# Altium schematic sheet PowerSupply.SchDoc: =ProjectDescription
size 420 x 297 mm; Address1: Address1; Address2: Address2; Address3: Address3; Address4: Address4; SheetNumber: 2; SheetTotal: 2; Scale: 1:1; DocumentType: Схема электрическая принципиальная
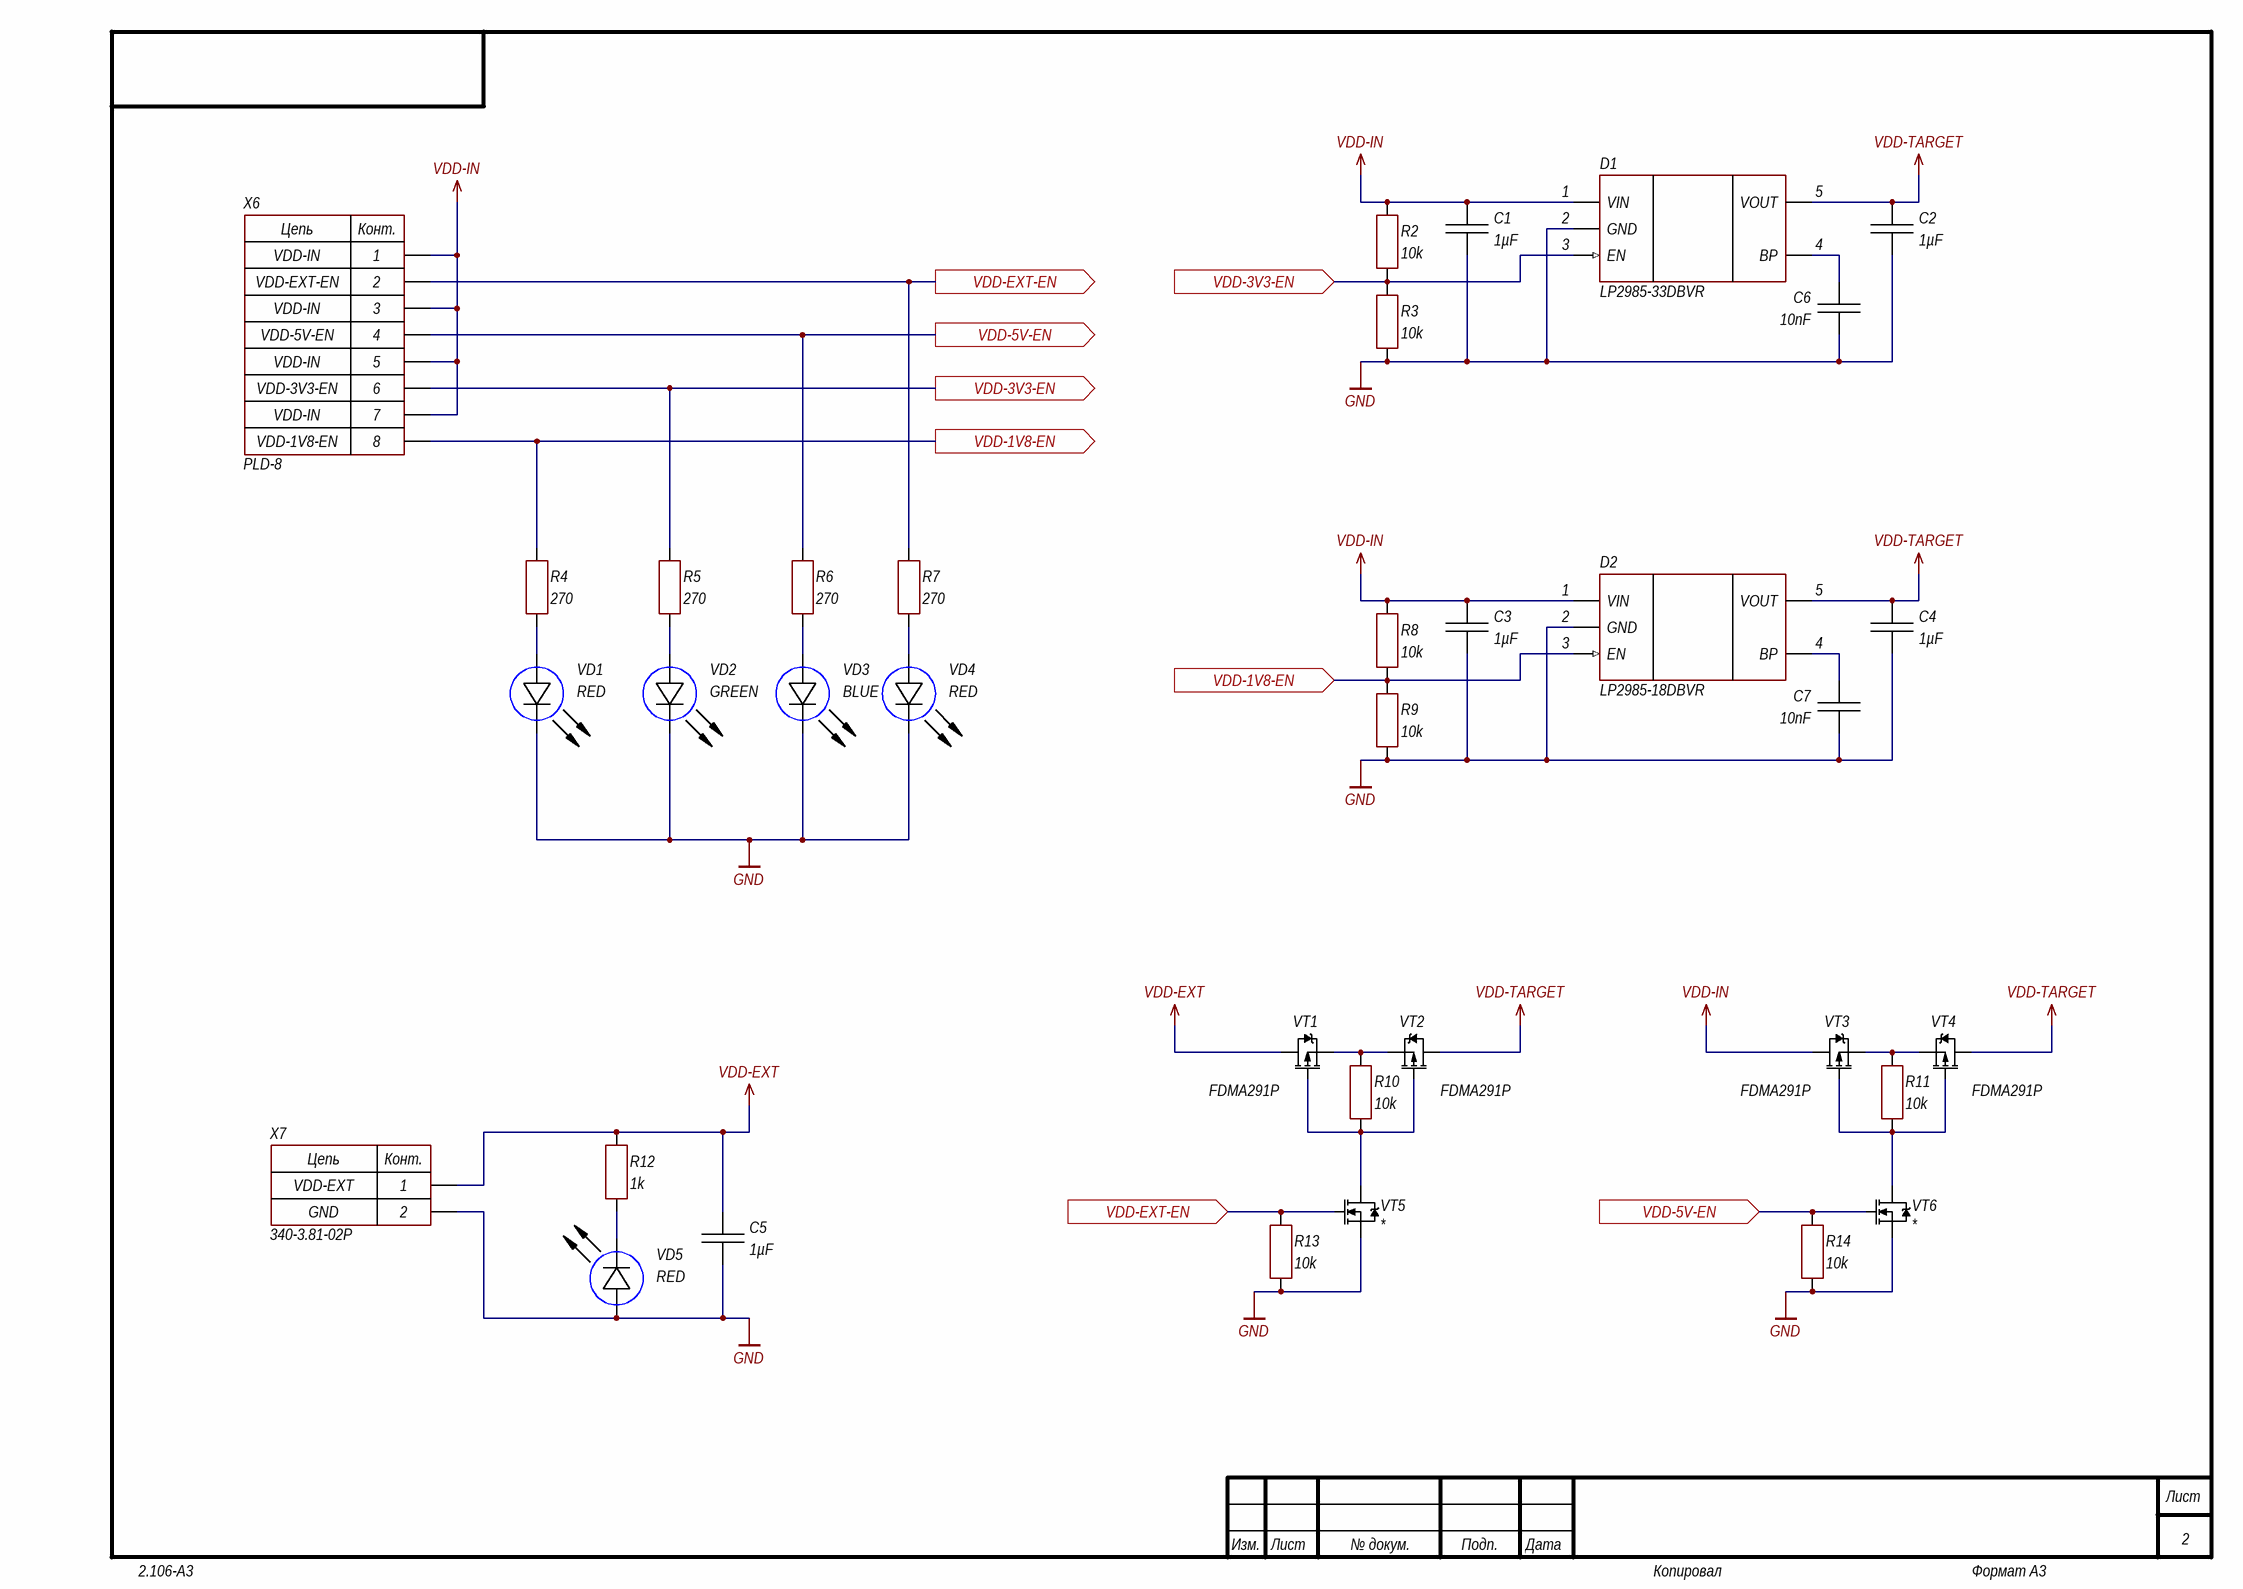
[diagram p0: PowerSupply.SchDoc]

## Parts
C1  1µF  [CH0603CM]
C2  1µF  [CH0603CM]
C3  1µF  [CH0603CM]
C4  1µF  [CH0603CM]
C5  1µF  [CH0603CM]
C6  10nF  [CH0603CM]
C7  10nF  [CH0603CM]
D1  LP2985-33DBVR  [SOT23-5]
D2  LP2985-18DBVR  [SOT23-5]
R2  10k  [CH0402R]
R3  10k  [CH0402R]
R4  270  [CH0402R]
R5  270  [CH0402R]
R6  270  [CH0402R]
R7  270  [CH0402R]
R8  10k  [CH0402R]
R9  10k  [CH0402R]
R10  10k  [CH0402R]
R11  10k  [CH0402R]
R12  1k  [CH0402R]
R13  10k  [CH0402R]
R14  10k  [CH0402R]
VD1  RED  [CH0402LR]
VD2  GREEN  [CH0402LG]
VD3  BLUE  [CH0402LB]
VD4  RED  [CH0402LR]
VD5  RED  [CH0402LR]
VT1  FDMA291P  [MicroFET 2x2]
VT2  FDMA291P  [MicroFET 2x2]
VT3  FDMA291P  [MicroFET 2x2]
VT4  FDMA291P  [MicroFET 2x2]
VT5  *  [DFN1006-3L]
VT6  *  [DFN1006-3L]
X6  PLD-8  [CON: PLD-8]
X7  340-3.81-02P  [CON: 340-3.81-02P]

## Ports
VDD-1V8-EN (in), VDD-1V8-EN (out), VDD-3V3-EN (in), VDD-3V3-EN (out), VDD-5V-EN (in), VDD-5V-EN (out), VDD-EXT-EN (in), VDD-EXT-EN (out)

## Nets
GND: C1.1 C2.1 C3.1 C4.1 C5.1 C6.1 C7.1 D1.2(GND) D2.2(GND) R3.1 R9.1 R13.1 R14.1 VD1.2(C) VD2.2(C) VD3.2(C) VD4.2(C) VD5.1(A) VT5.3(S) VT6.3(S) X7.2
VDD-EXT: C5.2 R12.2 VT1.2(D) X7.1
VDD-IN: C1.2 C3.2 D1.1(VIN) D2.1(VIN) R2.2 R8.2 VT3.2(D) X6.1 X6.3 X6.5 X6.7
VDD-TARGET: C2.2 C4.2 D1.5(VOUT) D2.5(VOUT) VT2.2(D) VT4.2(D)
VDD-1V8-EN: D2.3(EN) R4.2 R8.1 R9.2 X6.8 ; port VDD-1V8-EN
VDD-3V3-EN: D1.3(EN) R2.1 R3.2 R5.2 X6.6 ; port VDD-3V3-EN
VDD-5V-EN: R6.2 R14.2 VT6.1(G) X6.4 ; port VDD-5V-EN
VDD-EXT-EN: R7.2 R13.2 VT5.1(G) X6.2 ; port VDD-EXT-EN
NetC6_2: C6.2 D1.4(BP)
NetC7_2: C7.2 D2.4(BP)
NetR4_1: R4.1 VD1.1(A)
NetR5_1: R5.1 VD2.1(A)
NetR6_1: R6.1 VD3.1(A)
NetR7_1: R7.1 VD4.1(A)
NetR10_1: R10.1 VT1.1(G) VT2.1(G) VT5.2(D)
NetR10_2: R10.2 VT1.3(S) VT2.3(S)
NetR11_1: R11.1 VT3.1(G) VT4.1(G) VT6.2(D)
NetR11_2: R11.2 VT3.3(S) VT4.3(S)
NetR12_1: R12.1 VD5.2(C)

## Notes on the sheet
- VDD-IN
- VDD-EXT-EN
- VDD-5V-EN
- VDD-3V3-EN
- VDD-1V8-EN
- VDD-EXT
- GND
- Изм.
- Лист
- № докум.
- Подп.
- Дата
- 2.106-A3
- Копировал
- Формат А3
- (in symbol 2-Connector) Цепь; Конт.
- (in symbol 8-Connector) Цепь; Конт.

## Library data of the parts
C1-C7 = Capacitor: Manufacturer: *; Model: *; HelpURL: *; ComponentKind: *
  C1 C2: Value: 1µF; ClassName: LDO-3V3
  C3 C4: Value: 1µF; ClassName: LDO-1V8
  C5: Value: 1µF; ClassName: VDD-EXT-CONNECTOR
  C6: Value: 10nF; ClassName: LDO-3V3
  C7: Value: 10nF; ClassName: LDO-1V8
D1 D2 = LP2985-33DBVR: LDO; Manufacturer: Texas Instruments; HelpURL: https://www.digikey.com/product-detail/en/texas-instruments/LP2985-33DBVR/296-18476-1-ND/809911; ComponentKind: SOT-23-5
  D1: Model: LP2985-33DBVR; ClassName: LDO-3V3
  D2: Model: LP2985-18DBVR; ClassName: LDO-1V8
R2-R14 = Resistor: Manufacturer: *; Model: *; HelpURL: *; ComponentKind: *
  R2 R3: Value: 10k; ClassName: LDO-3V3
  R4-R7: Value: 270; ClassName: VDD-SWITCH
  R8 R9: Value: 10k; ClassName: LDO-1V8
  R10 R13: Value: 10k; ClassName: VDD-EXT-SWITCH
  R11 R14: Value: 10k; ClassName: VDD-5V-SWITCH
  R12: Value: 1k; ClassName: VDD-EXT-CONNECTOR
VD1-VD5 = LED: Manufacturer: *; Model: *; HelpURL: *; ComponentKind: *
  VD1 VD4: Value: RED; ClassName: VDD-SWITCH
  VD2: Value: GREEN; ClassName: VDD-SWITCH
  VD3: Value: BLUE; ClassName: VDD-SWITCH
  VD5: Value: RED; ClassName: VDD-EXT-CONNECTOR
VT1-VT4 = P-chanel: Mosfet; pin to pad: 1>3 2>1 3>2; Model: FDMA291P; Manufacturer: *; ComponentKind: *; HelpURL: *
  VT1 VT2: ClassName: VDD-EXT-SWITCH
  VT3 VT4: ClassName: VDD-5V-SWITCH
VT5 VT6 = N-chanel: Mosfet; Model: *; Manufacturer: *; ComponentKind: *; HelpURL: *
  VT5: ClassName: VDD-EXT-SWITCH
  VT6: ClassName: VDD-5V-SWITCH
X6 = 8-Connector: Model: PLD-8; Manufacturer: *; HelpURL: *; ComponentKind: *; ClassName: VDD-SWITCH
X7 = 2-Connector: Model: 340-3.81-02P; Manufacturer: *; HelpURL: *; ComponentKind: *; ClassName: VDD-EXT-CONNECTOR